# Altium schematic sheet Low_Current_Sense.SchDoc
size A; SheetNumber: 13; SheetTotal: 16
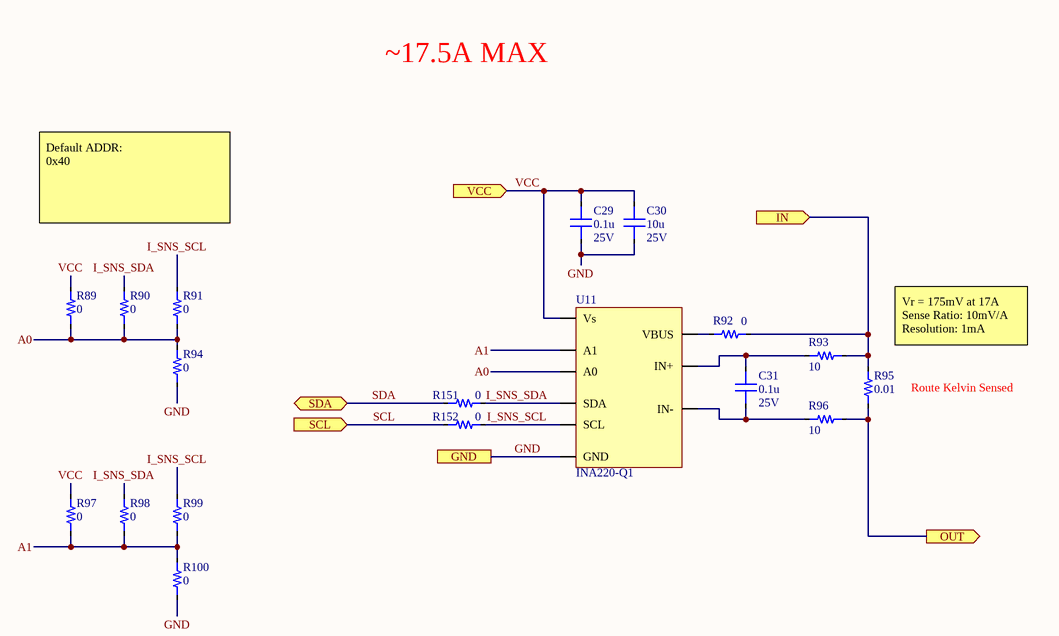
[diagram p0: Low_Current_Sense.SchDoc]

## Parts
C29  value 0.1u  Voltage: 25V  [0603_CAP]  (hidden comment: Capacitor)
C30  value 10u  Voltage: 25V  [0805_CAP]  (hidden comment: Capacitor)
C31  value 0.1u  Voltage: 25V  [0603_CAP]  (hidden comment: Capacitor)
R89  value 0  [0603_RES]  (hidden comment: Resistor)
R90  value 0  [0603_RES]  (hidden comment: Resistor)
R91  value 0  [0603_RES]  (hidden comment: Resistor)
R92  value 0  [0603_RES]  (hidden comment: Resistor)
R93  value 10  [0603_RES]  (hidden comment: Resistor)
R94  value 0  [0603_RES]  (hidden comment: Resistor)
R95  value 0.01  [2512_RES]  (hidden comment: Resistor)
R96  value 10  [0603_RES]  (hidden comment: Resistor)
R97  value 0  [0603_RES]  (hidden comment: Resistor)
R98  value 0  [0603_RES]  (hidden comment: Resistor)
R99  value 0  [0603_RES]  (hidden comment: Resistor)
R100  value 0  [0603_RES]  (hidden comment: Resistor)
R151  value 0  [0603_RES]  (hidden comment: Resistor)
R152  value 0  [0603_RES]  (hidden comment: Resistor)
U11  INA220-Q1  [TSSOP-10]

## Ports
GND, IN (in), OUT (out), SCL (in), SDA (bidir), VCC (in)

## Nets
A0: R89.1 R90.1 R91.1 R94.2 U11.2(A0)
A1: R97.1 R98.1 R99.1 R100.2 U11.1(A1)
GND: C29.1 C30.1 R94.1 R100.1 U11.7(GND) ; port GND
I_SNS_SCL: R91.2 R99.2 R152.2 U11.5(SCL)
I_SNS_SDA: R90.2 R98.2 R151.2 U11.4(SDA)
IN: R92.2 R93.2 R95.2 ; port IN
OUT: R95.1 R96.2 ; port OUT
SCL: R152.1 ; port SCL
SDA: R151.1 ; port SDA
VCC: C29.2 C30.2 R89.2 R97.2 U11.6(Vs) ; port VCC
NetC31_1: C31.1 R96.1 U11.9(IN-)
NetC31_2: C31.2 R93.1 U11.10(IN+)
NetR92_1: R92.1 U11.8(VBUS)

## Notes on the sheet
- ~17.5A MAX
- Default ADDR:
  0x40
- Vr = 175mV at 17A
  Sense Ratio: 10mV/A
  Resolution: 1mA
- (near R95) Route Kelvin Sensed

## Library data of the parts
R95 = Resistor: Tolerance: 1%; Power: 3
U11 = INA220-Q1: Current Monitor Regulator High/Low-Side 10mA 10-VSSOP; Name: INA220-Q1; ComponentLink1Description: Datasheet; ComponentLink1URL: https://www.analog.com/media/en/technical-documentation/data-sheets/6100fd.pdf; ComponentLink2Description: Digikey; ComponentLink2URL: https://www.digikey.com/product-detail/en/linear-technology-analog-devices/LT6100CMS8-TRPBF/LT6100CMS8-TRPBFCT-ND/7917234
C29-C31 = Capacitor: Dielectric: *; Percent Tolerance: *; ESR: *
R89-R94 R96-R100 R151 R152 = Resistor: Tolerance: *